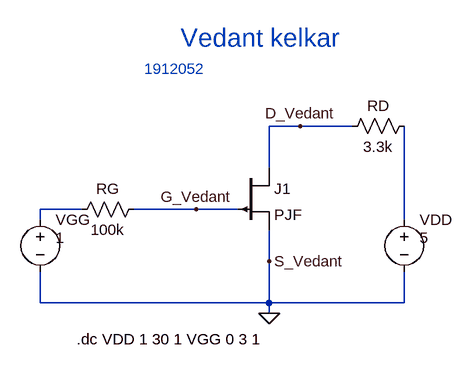
[diagram p0: schematic Draft25.asc]
Draft25.asc, the LTspice schematic file:
Version 4
SHEET 1 880 680
WIRE 304 48 256 48
WIRE 384 48 304 48
WIRE 256 112 256 48
WIRE -32 176 -96 176
WIRE 144 176 48 176
WIRE 208 176 144 176
WIRE -96 192 -96 176
WIRE 464 192 464 48
WIRE 256 256 256 208
WIRE -96 320 -96 272
WIRE 256 320 256 256
WIRE 256 320 -96 320
WIRE 464 320 464 272
WIRE 464 320 256 320
WIRE 256 336 256 320
FLAG 144 176 G_Vedant
FLAG 256 256 S_Vedant
FLAG 304 48 D_Vedant
FLAG 256 336 0
SYMBOL voltage -96 176 R0
WINDOW 123 0 0 Left 0
WINDOW 39 0 0 Left 0
WINDOW 3 24 44 Left 2
SYMATTR InstName VGG
SYMATTR Value 1
SYMBOL voltage 464 176 R0
WINDOW 123 0 0 Left 0
WINDOW 39 0 0 Left 0
WINDOW 3 24 44 Left 2
SYMATTR InstName VDD
SYMATTR Value 5
SYMBOL res 480 32 R90
WINDOW 0 0 56 VBottom 2
WINDOW 3 32 56 VTop 2
SYMATTR InstName RD
SYMATTR Value 3.3k
SYMBOL res 64 160 R90
WINDOW 0 0 56 VBottom 2
WINDOW 3 32 56 VTop 2
SYMATTR InstName RG
SYMATTR Value 100k
SYMBOL pjf 208 112 R0
SYMATTR InstName J1
TEXT 120 -88 Left 4 ;Vedant kelkar
TEXT 64 -40 Left 2 ;1912052
TEXT -40 376 Left 2 !.dc VDD 1 30 1 VGG 0 3 1

The netlist it stands for:
* Draft25.asc
VGG N001 0 1
VDD N002 0 5
RD N002 D_Vedant 3.3k
RG G_Vedant N001 100k
J1 D_Vedant G_Vedant 0 PJF
.model NJF NJF
.model PJF PJF
.lib standard.jft
* Vedant kelkar
* 1912052
.dc VDD 1 30 1 VGG 0 3 1
.backanno
.end